# EAGLE design StereoAmplifier-BA5412 (EAGLE 7.2.0)
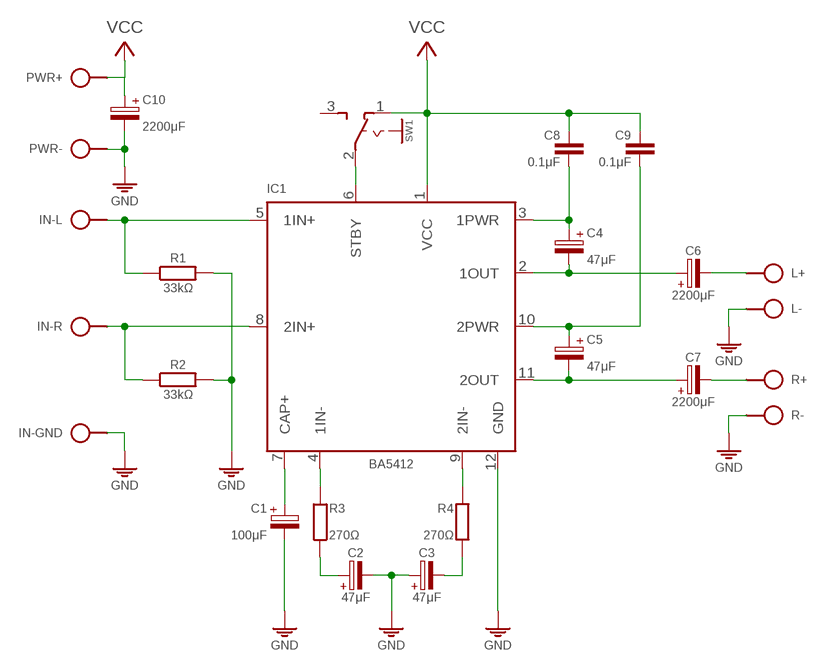
[diagram p0: schematic, sheet 1]

## Parts
C1  100μF  CPOLE2,5-4/V  [E2.5-4/V]
C2  47μF  CPOLE2,5-4/V  [E2.5-4/V]
C3  47μF  CPOLE2,5-4/V  [E2.5-4/V]
C4  47μF  CPOLE2,5-4/V  [E2.5-4/V]
C5  47μF  CPOLE2,5-4/V  [E2.5-4/V]
C6  2200μF  CPOLE5-6  [E5-6]
C7  2200μF  CPOLE5-6  [E5-6]
C8  0.1μF  C050-020X044  [C050-020X044]
C9  0.1μF  C050-020X044  [C050-020X044]
C10  2200μF  CPOLE5-6  [E5-6]
IC1  BA5412  [SIL12]
IN  SAUDIO  [SPAD-3]
L  SPAD+-  [SPAD+-]
PWR  SPAD+-  [SPAD+-]
R  SPAD+-  [SPAD+-]
R1  33kΩ  R-H0204/10  [0204/10]
R2  33kΩ  R-H0204/10  [0204/10]
R3  270Ω  R0204/10  [0204/10]
R4  270Ω  R0204/10  [0204/10]
SW1  SL-SW-1P-2T-H  [SLSW-1P2T-H]

## Nets
GND: C1.- C2.- C3.+ C10.- IC1.12(GND) IN.2 L.1 PWR.1 R1.2 R2.2 R.1
N$1: IC1.6(STBY) SW1.2(P)
N$2: IC1.5(1IN+) IN.1 R1.1
N$3: IC1.8(2IN+) IN.3 R2.1
N$5: C2.+ R3.1
N$6: IC1.4(1IN-) R3.2
N$7: IC1.9(2IN-) R4.2
N$8: C3.- R4.1
N$9: C1.+ IC1.7(CAP+)
N$10: C4.+ C8.2 IC1.3(1PWR)
N$11: C4.- C6.+ IC1.2(1OUT)
N$12: C5.- C7.+ IC1.11(2OUT)
N$13: C5.+ C9.2 IC1.10(2PWR)
N$14: C6.- L.2
N$15: C7.- R.2
VCC: C8.1 C9.1 C10.+ IC1.1(VCC) PWR.2 SW1.1(O)
Unconnected: SW1.3(S)

## Library data of the parts
C1-C7 C10 = c:CPOL: POLARIZED CAPACITOR, European symbol
C8 C9 = c:C: CAPACITOR, European symbol
IC1 = ic:BA5412
IN = pad:SAUDIO
L PWR R = pad:SPAD+-
R1 R2 = r:R-H
R3 R4 = r:R: RESISTOR, European symbol
SW1 = sw:SL-SW-1P-2T

## Board
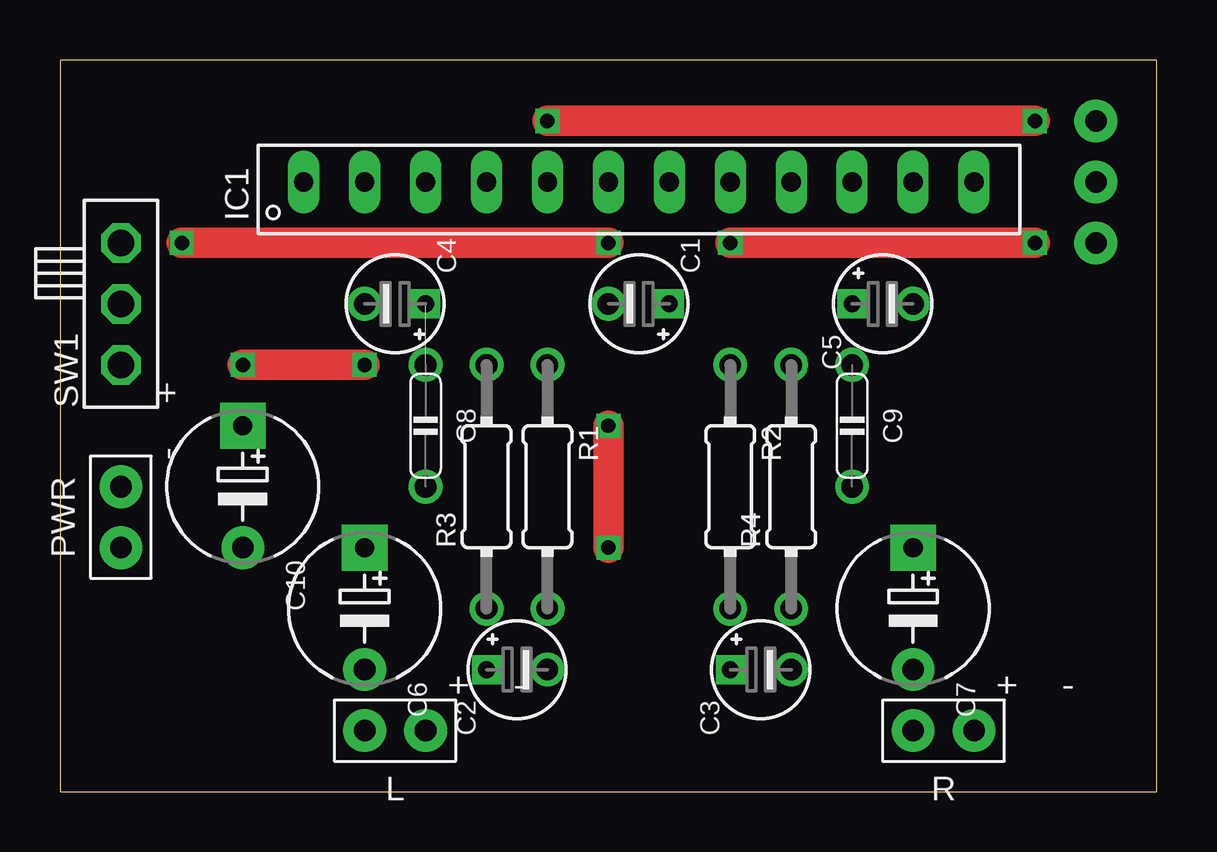
[diagram p1: board, top side]
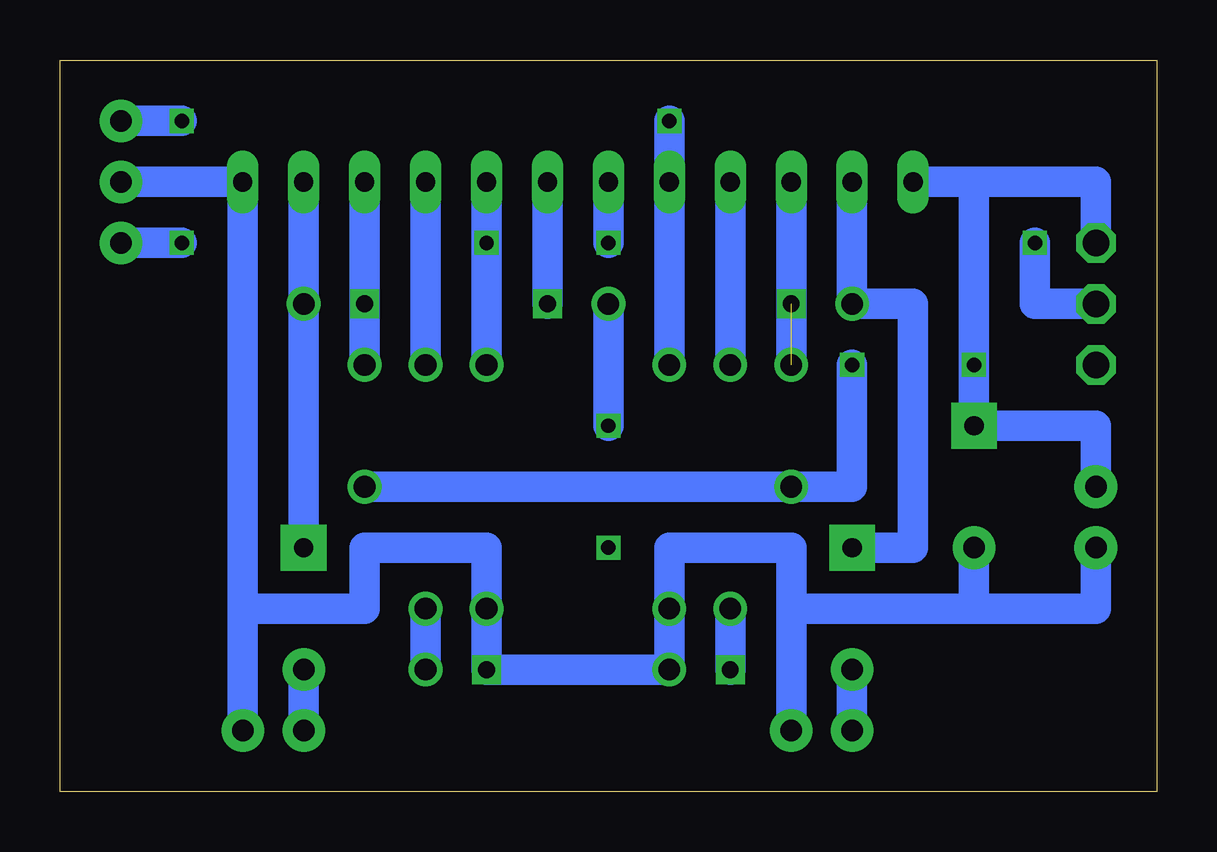
[diagram p2: board, bottom side, seen from below]

Size 45.72 x 30.48 mm. Coordinates in mm from the lower left corner, seen from the top.
Outline: 0,0 45.72,0 45.72,30.48 0,30.48 0,0
Copper layers (1*16): Top 0.035mm / dielectric 1.5mm / Bottom 0.035mm
Design rules "default": minimum track width 10mil, minimum drill 24mil, track to track 8mil, track to pad 8mil, pad to pad 8mil, via to via 8mil, smd to smd 8mil, copper to edge 40mil, drill to drill 8mil, minimum pad ring 10mil, minimum via ring 8mil, stop-mask expansion 4mil, vias tented up to drill 0mil, thermal gap 10mil

### Footprints (pad centres in the part's own frame; a part is rotated, then mirrored left to right if it is on the bottom)
E2.5-4/V = drill 0.7 square: + 0,1.27 | drill 0.9: - 0,-1.27
E5-6 = drill 0.8 pad 1.905 square: + -2.54,0 | drill 0.9 pad 1.778: - 2.54,0
C050-020X044 = drill 0.9: 1 2.54,0; 2 -2.54,0
SIL12 = drill 0.8 long: 1 0,13.97; 2 0,11.43; 3 0,8.89; 4 0,6.35; 5 0,3.81; 6 0,1.27; 7 0,-1.27; 8 0,-3.81; 9 0,-6.35; 10 0,-8.89; 11 0,-11.43; 12 0,-13.97
SPAD-3 = drill 0.9 pad 1.778: 1 -2.54,0; 2 0,0; 3 2.54,0
SPAD+- = drill 0.9 pad 1.778: 1 0,-1.27; 2 0,1.27
0204/10 = drill 0.9: 1 -5.08,0; 2 5.08,0
SLSW-1P2T-H = drill 1.1 pad 1.524 octagon: 1 2.54,0; 2 0,0; 3 -2.54,0

### Placement (x,y rotation side)
C1  24.13,20.32 270 top
C2  19.05,5.08 90 top
C3  29.21,5.08 90 top
C4  13.97,20.32 270 top
C5  34.29,20.32 90 top
C6  12.7,7.62 270 top
C7  35.56,7.62 270 top
C8  15.24,15.24 270 top
C9  33.02,15.24 270 top
C10  7.62,12.7 270 top
IC1  24.13,25.4 90 top
IN  43.18,25.4 270 top
L  13.97,2.54 90 top
PWR  2.54,11.43 0 top
R  36.83,2.54 90 top
R1  20.32,12.7 270 top
R2  27.94,12.7 270 top
R3  17.78,12.7 90 top
R4  30.48,12.7 90 top
SW1  2.54,20.32 90 top

### Tracks (layer width: path | path; a pad name or v marks a point on that pad's centre or on a via)
GND  (via drill 0.6)
  Top 1.27: v22.86,15.24 v22.86,10.16
  Bottom 1.27: PWR.1 2.54,7.62 7.62,7.62 | C10.- 7.62,7.62 | 7.62,7.62 15.24,7.62 | 15.24,7.62 15.24,10.16 20.32,10.16 R1.2 C2.- C3.+ R2.2 27.94,10.16 33.02,10.16 33.02,7.62 38.1,7.62 | 38.1,7.62 IC1.12 IN.2 | C1.- v22.86,15.24 | L.1 15.24,7.62 | R.1 38.1,7.62
N$1  (via drill 0.6)
  Top 1.27: v22.86,22.86 v5.08,22.86
  Bottom 1.27: IC1.6 v22.86,22.86 | v5.08,22.86 5.08,20.32 SW1.2
N$2  (via drill 0.6)
  Top 1.27: v40.64,27.94 v20.32,27.94
  Bottom 1.27: R1.1 IC1.5 v20.32,27.94 | IN.1 v40.64,27.94
N$3  (via drill 0.6)
  Top 1.27: v40.64,22.86 v27.94,22.86
  Bottom 1.27: R2.1 v27.94,22.86 IC1.8 | IN.3 v40.64,22.86
N$5
  Bottom 1.27: R3.1 C2.+
N$6
  Bottom 1.27: IC1.4 R3.2
N$7
  Bottom 1.27: IC1.9 R4.2
N$8
  Bottom 1.27: C3.- R4.1
N$9
  Bottom 1.27: C1.+ IC1.7
N$10  (1 unrouted)
  Bottom 1.27: C8.2 IC1.3
N$11
  Bottom 1.27: C6.+ 10.16,10.16 10.16,20.32 C4.- IC1.2
N$12
  Bottom 1.27: C7.+ C5.- IC1.11
N$13
  Bottom 1.27: IC1.10 C5.+ C9.2
N$14
  Bottom 1.27: L.2 C6.-
N$15
  Bottom 1.27: C7.- R.2
VCC  (via drill 0.6)
  Top 1.27: v12.7,17.78 v7.62,17.78
  Bottom 1.27: C9.1 C8.1 12.7,12.7 v12.7,17.78 | IC1.1 7.62,25.4 | 7.62,25.4 v7.62,17.78 C10.+ 2.54,15.24 PWR.2 | 7.62,25.4 2.54,25.4 SW1.1